# EAGLE design BitBeacon_Emitter (EAGLE 7.4.0)
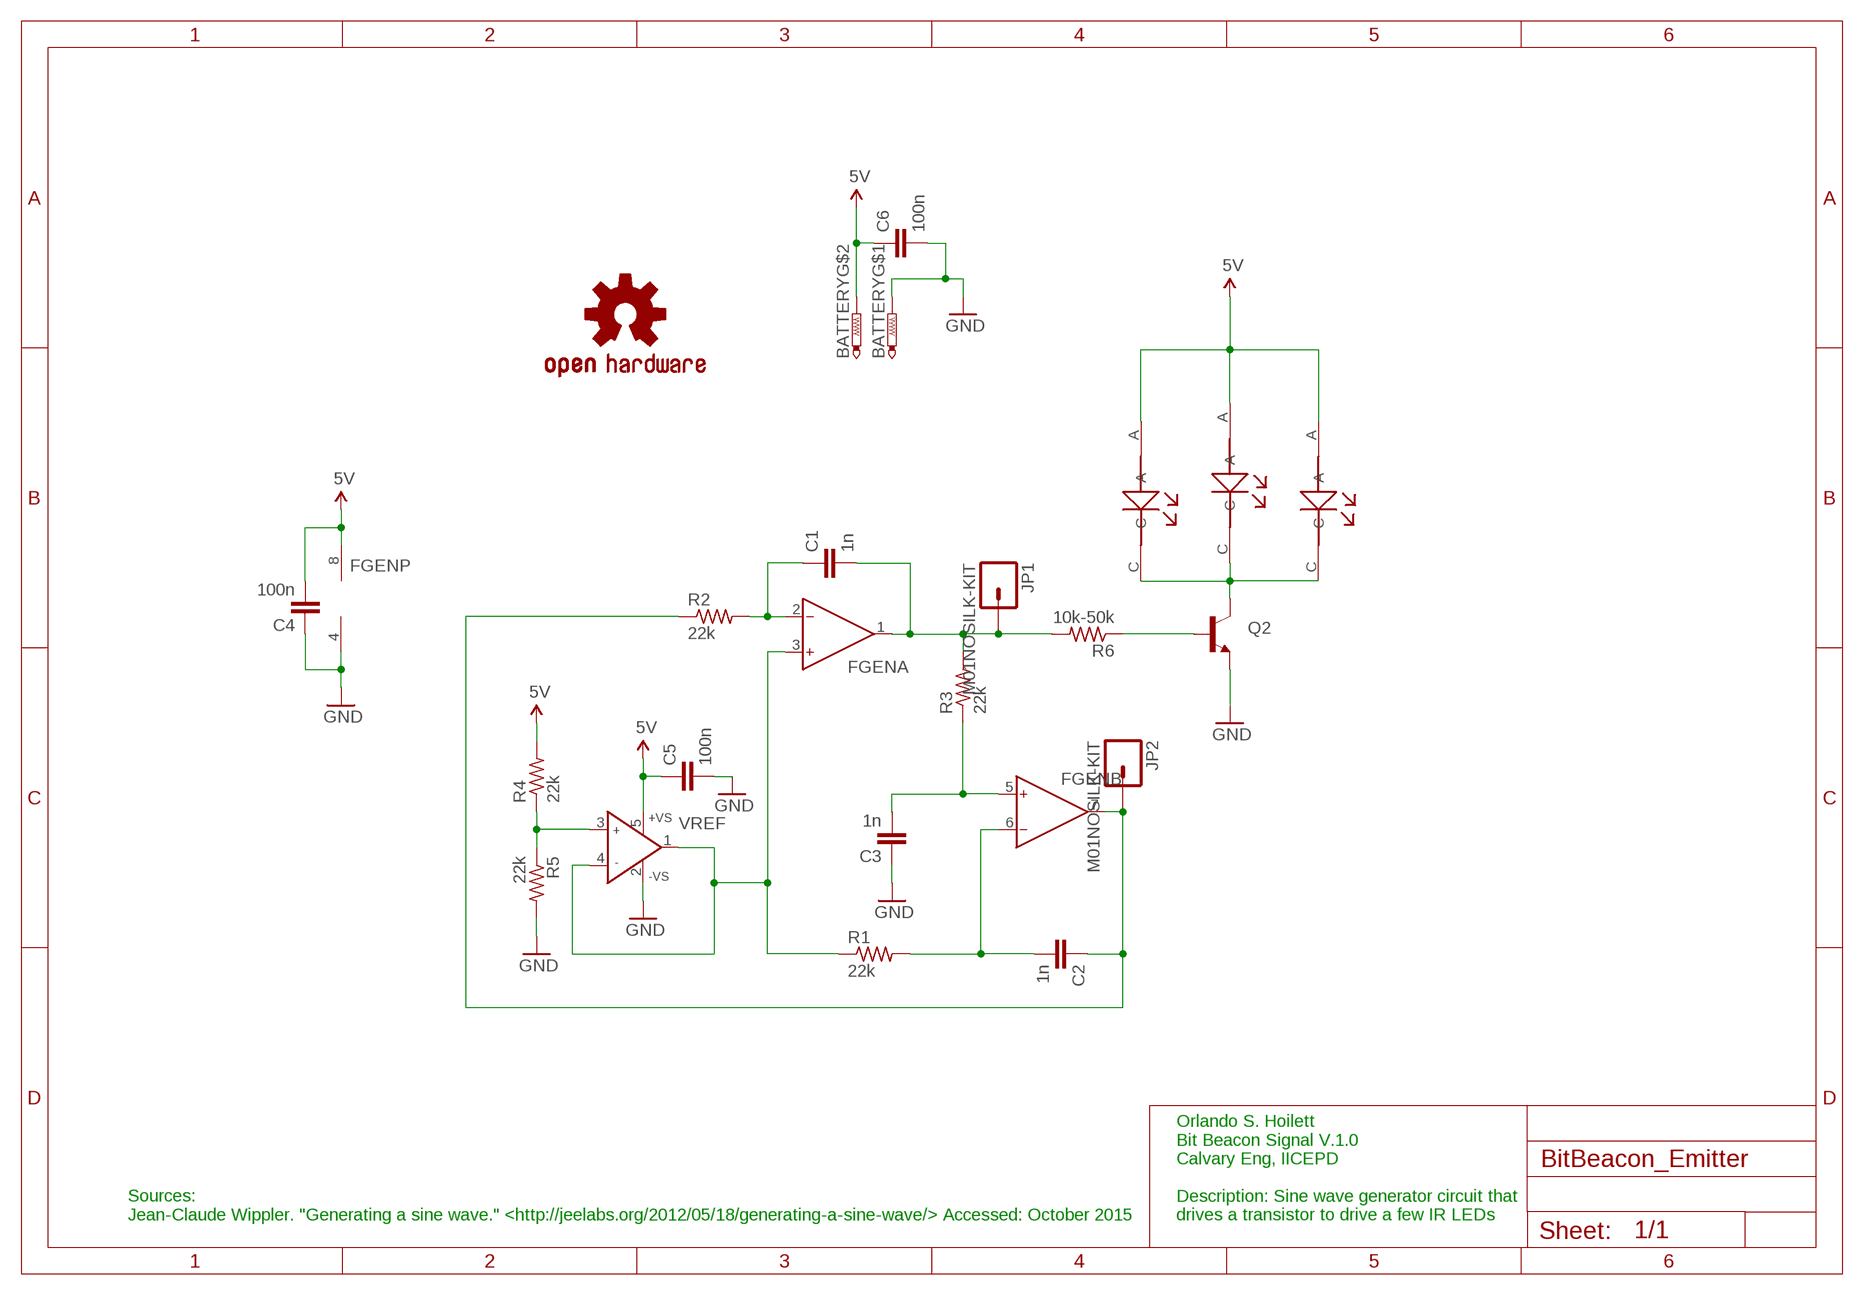
[diagram p0: schematic, sheet 1]

## Parts
BATTERY  BATT-CONNECT  [HOLE]
C1  1n  C-EUC0402  [C0402]
C2  1n  C-EUC0402  [C0402]
C3  1n  C-EUC0402  [C0402]
C4  100n  C-EUC0402  [C0402]
C5  100n  C-EUC0402  [C0402]
C6  100n  C-EUC0402  [C0402]
FGEN  AD8607RM  [MSOP08]
JP1  M01NOSILK-KIT  [1X01NS-KIT]
JP2  M01NOSILK-KIT  [1X01NS-KIT]
LED1  LED  [LED]
LED2  LED  [LED]
LED3  LED  [LED]
LOGO1  OSHW-LOGOS  [OSHW-LOGO-S]
Q2  TRANSISTOR_NPN2N3904  [TO-92]
R1  22k  R-US_R0402  [R0402]
R2  22k  R-US_R0402  [R0402]
R3  22k  R-US_R0402  [R0402]
R4  22k  R-US_R0402  [R0402]
R5  22k  R-US_R0402  [R0402]
R6  10k-50k  R-US_R0402  [R0402]
VREF  AD8603UJ  [SOT23-5]

## Nets
5V: BATTERY.P$2 C4.2 C5.1 C6.1 FGEN.8(P:V+) LED1.A LED2.A LED3.A R4.2 VREF.5(+VS)
COSINE: C2.1 FGEN.7(B:OUT) JP2.1 R2.1
GND: BATTERY.P$1 C3.1 C4.1 C5.2 C6.2 FGEN.4(P:V-) Q2.1(E) R5.2 VREF.2(-VS)
N$2: C3.2 FGEN.5(B:IN+) R3.1
N$3: C1.1 FGEN.2(A:IN-) R2.2
N$5: C2.2 FGEN.6(B:IN-) R1.2
N$6: FGEN.3(A:IN+) R1.1 VREF.1(OUT) VREF.4(IN-)
N$7: R4.1 R5.1 VREF.3(IN+)
N$8: LED1.C LED2.C LED3.C Q2.3(C)
N$9: Q2.2(B) R6.1
SINE: C1.2 FGEN.1(A:OUT) JP1.1 R3.2 R6.2

## Notes on the sheet
- Sources:
  Jean-Claude Wippler. "Generating a sine wave." <http://jeelabs.org/2012/05/18/generating-a-sine-wave/> Accessed: October 2015
- Orlando S. Hoilett
  Bit Beacon Signal V.1.0
  Calvary Eng, IICEPD
  
  Description: Sine wave generator circuit that
  drives a transistor to drive a few IR LEDs

## Library data of the parts
BATTERY = OrlandoRonMod:BATT-CONNECT
C1-C6 = resistor:C-EU: CAPACITOR, European symbol
FGEN = analog-devices:AD8607: Precision Micropower, Low Noise CMOS, Rail-to-Rail Input/Output Operational Amplifiers Source: http://www.analog.com/static/imported-files/data_sheets/AD8603_8607_8609.pdf; MF: ALTERA CORPORATION; MPN: AD8607ARMZ-REEL; OC_FARNELL: 1464990; OC_NEWARK: 59K6925
JP1 JP2 = SparkFun-Connectors:M01: Header 1 Standard 1-pin 0.1" header. Use with straight break away headers (SKU : PRT-00116), right angle break away headers (PRT-00553), swiss pins (PRT-00743), machine pins (PRT-00117), and female headers (PRT-00115).
LED1-LED3 = Orlando:LED
LOGO1 = SparkFun-Aesthetics:OSHW-LOGO: Open Source Hardware Logo This logo indicates the piece of hardware it is found on incorporates a OSHW license and/or adheres to the definition of open source hardware found here: http://freedomdefined.org/OSHW
Q2 = SparkFun-DiscreteSemi:TRANSISTOR_NPN: Generic NPN BJT MMBT2222A - TRANS-08049 (SOT-23, 1A 40V) MPSA42 - TRANS-09116 (SOT-23, 500mA 300V) MMBT5088LT1G - TRANS-11160 (SOT-23, 50 mA 30V) BC547 - COM-08928 <http://www.sparkfun.com/products/8928> (TO-92 45V 100mA) (1.Collector 2.Base 3.Emitter) 2N3904 - COM-00521 <http://www.sparkfun.com/products/521> (TO-92 40V 200mA) (1.Emitter 2.Base 3.Collector) P2N2222A - COM-12852 <http://www.sparkfun.com/products/12852> (TO-92 40V 600mA) (1.Collector 2.Base 3.Emitter); PROD_ID: TRANS-08447
R1-R6 = resistor:R-US_: RESISTOR, American symbol
VREF = analog-devices:AD8603: Precision Micropower, Low Noise CMOS, Rail-to-Rail Input/Output Operational Amplifiers Source: http://www.analog.com/static/imported-files/data_sheets/AD8603_8607_8609.pdf; MF: ALTERA CORPORATION; MPN: AD8603AUJZ-REEL7; OC_FARNELL: 1651290; OC_NEWARK: 59K6904

## Board
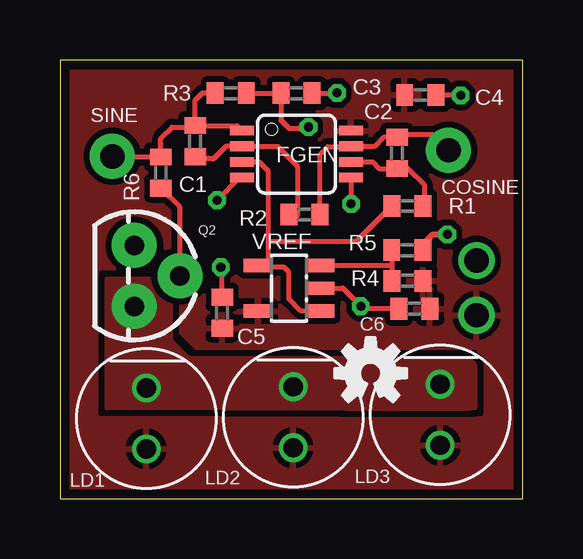
[diagram p1: board, top side]
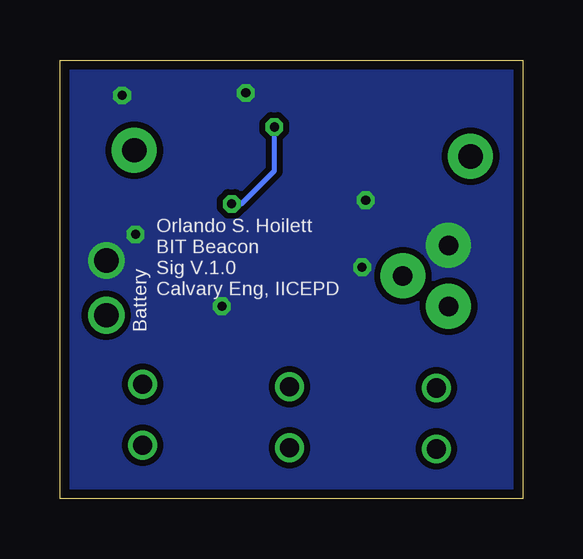
[diagram p2: board, bottom side, seen from below]

Size 19.3 x 18.29 mm. Coordinates in mm from the lower left corner, seen from the top.
Outline: 0,0 19.3,0 19.3,18.29 0,18.29 0,0
Copper layers (1*16): Top 0.0356mm / dielectric 1.5011mm / Bottom 0.0356mm
Design rules "LaenPCBOrder": minimum track width 6mil, minimum drill 13mil, track to track 6mil, track to pad 6mil, pad to pad 6mil, via to via 6mil, smd to smd 6mil, copper to edge 15mil, drill to drill 6mil, minimum pad ring 7mil, minimum via ring 7mil, stop-mask expansion 3mil, vias tented up to drill 0mil, thermal gap 10mil

### Footprints (pad centres in the part's own frame; a part is rotated, then mirrored left to right if it is on the bottom)
HOLE = drill 1.016: P$1 -1.151,0; P$2 1.135,0
C0402 = smd 0.7 x 0.9: 1 -0.65,0; 2 0.65,0
MSOP08 = smd 0.4 x 1: 1 -0.976,-2.263; 2 -0.326,-2.263; 3 0.324,-2.263; 4 0.974,-2.263; 5 0.974,2.262; 6 0.324,2.262; 7 -0.326,2.262; 8 -0.976,2.262
1X01NS-KIT = drill 1.016 pad 1.88: 1 0,0
LED = drill 0.8: A -1.27,0; C 1.27,0
TO-92 = drill 0.813 pad 1.88: 1 -1.27,0; 2 0,1.905; 3 1.27,0
R0402 = smd 0.7 x 0.9: 1 -0.65,0; 2 0.65,0
SOT23-5 = smd 0.55 x 1.2: 1 -0.95,-1.3; 2 0,-1.3; 3 0.95,-1.3; 4 0.95,1.3; 5 -0.95,1.3

### Placement (x,y rotation side)
BATTERY  17.37,8.79 270 top
C1  5.64,14.91 90 top
C2  14.06,14.42 270 top
C3  9.87,16.91 180 top
C4  15.02,16.83 180 top
C5  6.76,7.76 90 top
C6  14.78,7.92 180 top
FGEN  9.87,14.37 270 top
JP1  2.18,14.27 0 top
JP2  16.21,14.53 0 top
LED1  3.6,3.35 90 top
LED2  9.73,3.41 90 top
LED3  15.86,3.51 90 top
LOGO1  12.95,5.23 0 top
Q2  3.1,9.3 270 top
R1  14.49,12.21 0 top
R2  10.2,11.85 180 top
R3  7.12,16.91 180 top
R4  14.49,9.09 0 top
R5  14.49,10.36 0 top
R6  4.21,13.6 90 top
VREF  9.56,8.78 90 top

### Tracks (layer width: path | path; a pad name or v marks a point on that pad's centre or on a via)
5V
  pour Top (isolate 0.254, rank 2): 0,18.29 19.3,18.29 19.3,0 0,0
COSINE
  Top 0.203: R2.1 10.85,14.35 11.18,14.68 12.12,14.68 FGEN.7 13.11,14.68 13.49,15.07 C2.1 14.18,15.19 15.54,15.19 JP2.1
GND  (via drill 0.38)
  Top 0.203: C5.2 6.76,9.59 v6.71,9.65 | VREF.2 11.8,8.78 v12.55,8.03 12.65,7.92 C6.2 | FGEN.4 7.5,13.39 v6.55,12.45 | C3.1 11.5,16.91 v11.56,16.92 | C4.1 16.65,16.83 v16.71,16.82
  Top 0.254: R5.2 15.13,10.61 15.54,11.02 v16.15,11.02
  pour Bottom (isolate 0.254, no thermals): 19.3,18.29 19.3,0 0,0 0,18.29
N$2  (via drill 0.38)
  Top 0.203: FGEN.5 12.13,12.31 v12.14,12.29 | R3.1 C3.2 9.22,15.78 9.55,15.44 10.31,15.44 v10.36,15.49
  Bottom 0.203: v12.14,12.29 11.73,12.29 10.36,13.66 v10.36,15.49
N$3
  Top 0.203: C1.1 5.72,14.17 6.4,14.17 6.92,14.69 FGEN.2 9.08,14.69 9.91,13.87 9.91,11.8 R2.2
N$5
  Top 0.203: FGEN.6 13.03,14.04 13.31,13.77 C2.2 | C2.2 | C2.2 14.53,13.77 15.19,13.11 15.19,12.26 R1.2
N$6
  Top 0.203: VREF.1 10.05,7.83 9.55,8.33 9.55,9.45 9.35,9.65 8.76,9.65 | 8.76,9.65 8.33,9.65 VREF.4 | FGEN.3 8.31,14.04 8.69,13.66 8.69,10.72 | 8.69,10.72 8.69,9.73 8.76,9.65 | 8.69,10.72 12.35,10.72 R1.1
N$7
  Top 0.203: R5.1 13.83,9.7 | 13.83,9.7 R4.1 | VREF.3 13.81,9.73 13.83,9.7
N$8
  pour Top (isolate 0.254, no thermals): 3.81,9.14 4.57,8.38 4.57,6.6 5.33,5.84 17.02,5.84 17.27,5.59 17.27,3.81 16.87,3.76 1.98,3.81 1.98,9.14
N$9
  Top 0.203: Q2.2 5,12.15 R6.1
SINE
  Top 0.203: C1.2 7.39,15.56 FGEN.1 | C1.2 5.57,15.49 4.67,15.49 4.21,15.03 R6.2 2.21,14.24 JP1.1 | C1.2 5.64,16.61 5.94,16.92 R3.2

### Text on the board
tNames: SINE | COSINE | LD1 | LD2 | LD3
bNames: Battery
_bsilk: Orlando S. Hoilett / BIT Beacon / Sig V.1.0 / Calvary Eng, IICEPD